# Altium schematic sheet CONVERTER.SchDoc
size A3; SheetNumber: 3; SheetTotal: 3
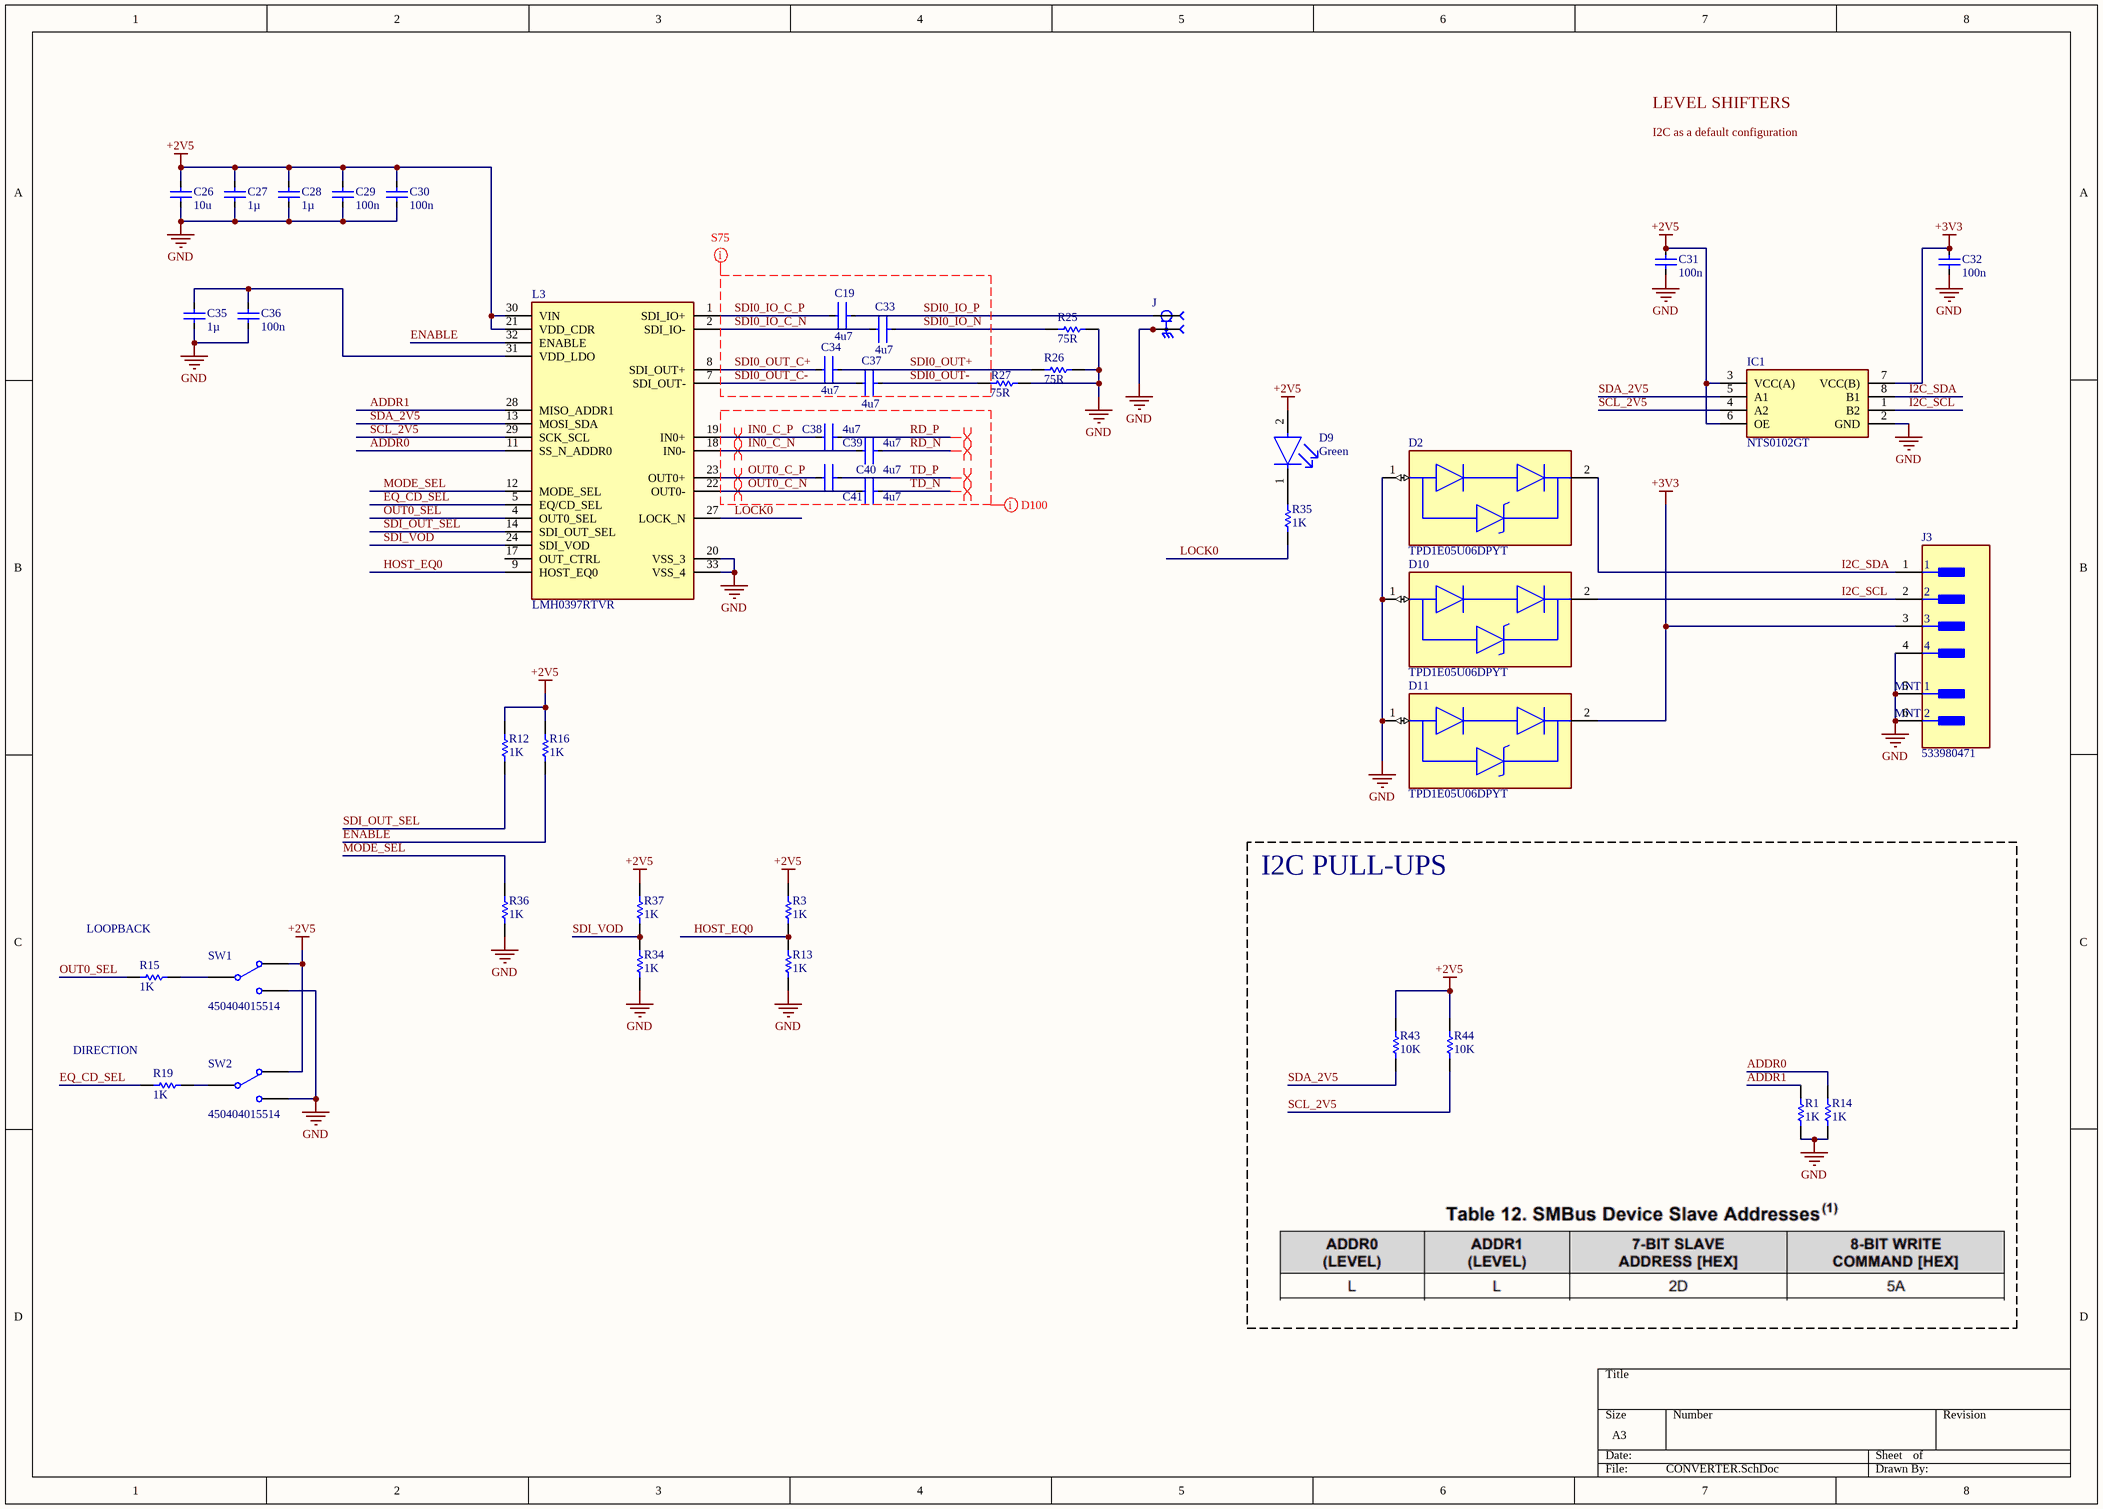
[diagram p0: CONVERTER.SchDoc]

## Parts
C19  value 4u7  [FP-GRM155-0_1-MFG]  (hidden comment: GRM155R60J475ME47D)
C26  value 10u  [FP-C1608-080-0_1-IPC_C]  (hidden comment: C1608JB0J106K080AB)
C27  value 1µ  [CAPC1005X55X10NL05]  (hidden comment: C1005X5R1A105K050BB)
C28  value 1µ  [CAPC1005X55X10NL05]  (hidden comment: C1005X5R1A105K050BB)
C29  value 100n  [FP-C1005-050-0_05-IPC_C]  (hidden comment: C1005X7R1H104K050BB)
C30  value 100n  [FP-C1005-050-0_05-IPC_C]  (hidden comment: C1005X7R1H104K050BB)
C31  value 100n  [FP-C1005-050-0_05-IPC_C]  (hidden comment: C1005X7R1H104K050BB)
C32  value 100n  [FP-C1005-050-0_05-IPC_C]  (hidden comment: C1005X7R1H104K050BB)
C33  value 4u7  [FP-GRM155-0_1-MFG]  (hidden comment: GRM155R60J475ME47D)
C34  value 4u7  [FP-GRM155-0_1-MFG]  (hidden comment: GRM155R60J475ME47D)
C35  value 1µ  [CAPC1005X55X10NL05]  (hidden comment: C1005X5R1A105K050BB)
C36  value 100n  [FP-C1005-050-0_05-IPC_C]  (hidden comment: C1005X7R1H104K050BB)
C37  value 4u7  [FP-GRM155-0_1-MFG]  (hidden comment: GRM155R60J475ME47D)
C38  value 4u7  [FP-GRM155-0_1-IPC_B]  (hidden comment: GRM155R60J475ME47D)
C39  value 4u7  [FP-GRM155-0_1-IPC_B]  (hidden comment: GRM155R60J475ME47D)
C40  value 4u7  [FP-GRM155-0_1-IPC_B]  (hidden comment: GRM155R60J475ME47D)
C41  value 4u7  [FP-GRM155-0_1-IPC_B]  (hidden comment: GRM155R60J475ME47D)
D2  TPD1E05U06DPYT  [FP-DPY0002A-MFG]
D9  Color: Green  [FP-LTST-C191GKT-MFG]  (hidden comment: LTST-C191GKT)
D10  TPD1E05U06DPYT  [FP-DPY0002A-MFG]
D11  TPD1E05U06DPYT  [FP-DPY0002A-MFG]
IC1  NTS0102GT  [NTS0102GT]
J  BNC7T-J-P-XX-ST-EM1D  [SAMTEC_BNC7T-J-P-XX-ST-EM1D]  (value not drawn)
J3  533980471  [FP-533980471-MFG]
L3  LMH0397RTVR  [QFN50P500X500X80-33N-D]
R1  value 1K  [RESC1005X40X25LL05T10]  (hidden comment: RC0402FR-071KL)
R3  value 1K  [RESC1005X40X25LL05T10]  (hidden comment: RC0402FR-071KL)
R12  value 1K  [RESC1005X40X25LL05T10]  (hidden comment: RC0402FR-071KL)
R13  value 1K  [RESC1005X40X25LL05T10]  (hidden comment: RC0402FR-071KL)
R14  value 1K  [RESC1005X40X25LL05T10]  (hidden comment: RC0402FR-071KL)
R15  value 1K  [RESC1005X40X25LL05T10]  (hidden comment: RC0402FR-071KL)
R16  value 1K  [RESC1005X40X25LL05T10]  (hidden comment: RC0402FR-071KL)
R19  value 1K  [RESC1005X40X25LL05T10]  (hidden comment: RC0402FR-071KL)
R25  value 75R  [RESC1005X40X25LL05T10]  (hidden comment: RC0402FR-0775RL)
R26  value 75R  [RESC1005X40X25LL05T10]  (hidden comment: RC0402FR-0775RL)
R27  value 75R  [RESC1005X40X25LL05T10]  (hidden comment: RC0402FR-0775RL)
R34  value 1K  [RESC1005X40X25LL05T10]  (hidden comment: RC0402FR-071KL)
R35  value 1K  [RESC1005X40X25LL05T10]  (hidden comment: RC0402FR-071KL)
R36  value 1K  [RESC1005X40X25LL05T10]  (hidden comment: RC0402FR-071KL)
R37  value 1K  [RESC1005X40X25LL05T10]  (hidden comment: RC0402FR-071KL)
R43  value 10K  [RESC1005X40X25LL05T10]  (hidden comment: RC0402FR-0710KL)
R44  value 10K  [RESC1005X40X25LL05T10]  (hidden comment: RC0402FR-0710KL)
SW1  450404015514  [450404015514]
SW2  450404015514  [450404015514]

## Blocks framed on the sheet
I2C PULL-UPS: R1 R14 R43 R44

## Nets
+2V5: C26.1 C27.1 C28.1 C29.1 C30.1 C31.1 D9.2(A) IC1.3(VCC(A)) IC1.6(OE) L3.21(VDD_CDR) L3.30(VIN) R3.1 R12.1 R16.1 R37.1 R43.1 R44.1 SW1.L1 SW2.L1
+3V3: C32.1 D11.2(GND) IC1.7(VCC(B)) J3.3
GND: C26.2 C27.2 C28.2 C29.2 C30.2 C31.2 C32.2 C35.2 C36.2 D2.1(I/O) D10.1(I/O) D11.1(I/O) IC1.2(GND) J.S1 J.S2 J.S3 J.S4 J3.4 J3.5(MNT_1) J3.6(MNT_2) L3.20(VSS_3) L3.33(VSS_4) R1.2 R13.2 R14.2 R25.2 R26.2 R27.2 R34.2 R36.2 SW1.L2 SW2.L2
ADDR0: L3.11(SS_N_ADDR0) R14.1
ADDR1: L3.28(MISO_ADDR1) R1.1
ENABLE: L3.32(ENABLE) R16.2
EQ_CD_SEL: L3.5(EQ/CD_SEL) R19.1
HOST_EQ0: L3.9(HOST_EQ0) R3.2 R13.1
I2C_SCL: D10.2(GND) IC1.1(B2) J3.2
I2C_SDA: D2.2(GND) IC1.8(B1) J3.1
IN0_C_N: C39.2 L3.18(IN0-)
IN0_C_P: C38.2 L3.19(IN0+)
LOCK0: L3.27(LOCK_N) R35.2
MODE_SEL: L3.12(MODE_SEL) R36.1
OUT0_C_N: C41.2 L3.22(OUT0-)
OUT0_C_P: C40.2 L3.23(OUT0+)
OUT0_SEL: L3.4(OUT0_SEL) R15.1
RD_N: C39.1
RD_P: C38.1
SCL_2V5: IC1.4(A2) L3.29(SCK_SCL) R44.2
SDA_2V5: IC1.5(A1) L3.13(MOSI_SDA) R43.2
SDI0_IO_C_N: C33.2 L3.2(SDI_IO-)
SDI0_IO_C_P: C19.2 L3.1(SDI_IO+)
SDI0_IO_N: C33.1 R25.1
SDI0_IO_P: C19.1 J.1
SDI0_OUT+: C34.1 R26.1
SDI0_OUT-: C37.1 R27.1
SDI0_OUT_C+: C34.2 L3.8(SDI_OUT+)
SDI0_OUT_C-: C37.2 L3.7(SDI_OUT-)
SDI_OUT_SEL: L3.14(SDI_OUT_SEL) R12.2
SDI_VOD: L3.24(SDI_VOD) R34.1 R37.2
TD_N: C41.1
TD_P: C40.1
NetC35_1: C35.1 C36.1 L3.31(VDD_LDO)
NetD9_1: D9.1(C) R35.1
NetR15_2: R15.2 SW1.COM
NetR19_2: R19.2 SW2.COM

Not connected (* = marked no-connect by the designer): L3 17(OUT_CTRL)

## Layout directives
differential pair: IN0_C_N, IN0_C_P, OUT0_C_N, OUT0_C_P, RD_N, RD_P, TD_N, TD_P
net class SDI: SDI0_IO_C_N, SDI0_IO_C_P, SDI0_IO_N, SDI0_IO_P, SDI0_OUT+, SDI0_OUT-, SDI0_OUT_C+, SDI0_OUT_C-
net class D100: IN0_C_N, IN0_C_P, OUT0_C_N, OUT0_C_P, RD_N, RD_P, TD_N, TD_P

## Notes on the sheet
- (near R15) LOOPBACK
- (near R19) DIRECTION
- Labels drawn without touching a wire or pin: I2C as a default configuration, LEVEL SHIFTERS

## Library data of the parts
C19 C33 C34 C37-C41 = CMP-2008-04549-2: Chip Multilayer Ceramic Capacitors for General Purpose, 0402, 4.7uF, X5R, 15%, 20%, 6.3V; Height: 0.5mm; Weight: 0.000212oz; Length: 1mm; Case Code (Metric): 1005; Packaging: Tape and Reel; Termination: SMD/SMT; Dielectric: X5R; Depth: 0.5mm; Case Code (Imperial): 0402; Min Operating Temperature: -55°C; Case/Package: 0402; Voltage: 6.3V; Width: 0.02inch; Lead Free: Lead Free; Thickness: 0.022inch; Contact Plating: Tin; REACH SVHC: No SVHC; Package Quantity: 10000; Tolerance: 20%; Voltage Rating (DC): 6.3V; Voltage Rating: 6.3V; Mount: Surface Mount; Max Operating Temperature: 85°C
C26 = C1608JB0J106K080AB: MLCC 10μF ±10% 6.3V JB SMD 0603; Dielectric Material: Ceramic; Case Code (Imperial): 0603; Thickness: 0.035inch; Min Operating Temperature: -25°C; Termination: SMD/SMT; Lead Free: Lead Free; Resistor Type: Ceramic; Width: 0.8mm; Voltage Rating (DC): 6.3V; Package Quantity: 4000; Tolerance: 10%; Length: 0.063inch; Series: C; Height: 0.8mm; Max Operating Temperature: 85°C; Mount: Surface Mount; RoHS Compliant: Yes; Voltage Rating: 6.3V; Case Code (Metric): 1608; Case/Package: 0603; Packaging: Tape and Reel
C27 C28 C35 = C1005X5R1A105K050BB: MLCC 1 uF, +/- 10%, 10 V, -55 to 85 degC, 0402 (1005 Metric), RoHS, Tape and Reel; Manufacturer: TDK; PCN Part Number: MLCCPartNumberChange30/Nov/2012; Product Training Modules: CSeriesGeneralApplicationsSEAT,CCV,andTVCLDesignToolsGuidetoReplacinganElectrolyticCapacitorwithanMLCC; Voltage - Rated: 10V; Temperature Coefficient: X5R; Online Catalog: CSeries,GeneralPurpose; Other Names: 445-4114-6; Category: Capacitors; Features: -; Lead Style: -; RoHS Information: RoHSCertificate-MLCC; Manufacturer URL: http://www.tdk.com/; Lead Spacing: -; Thickness (Max): 0.022"(0.55mm); Applications: GeneralPurpose; Tolerance: ±10%; Mounting Technology: SurfaceMount; Mounting Type: SurfaceMount,MLCC; Operating Temperature: -55°C~85°C; Datasheet URL: http://download.siliconexpert.com/pdfs/2015/4/21/15/54/45/779/tdk_/manual/37024850441143360mlcc_commercial_general_en.pdf; Package Reference: 1005; Height - Seated (Max): -; Family: CeramicCapacitors; Datasheet Version: 03/2015; Package Description: 2-Pin Surface Mount Device, Body 1 x 0.5 mm; Packaging: Digi-Reel®; Size / Dimension: 0.039"Lx0.020"W(1.00mmx0.50mm); Standard Package: 1; Package / Case: 0402(1005Metric); Ratings: -; Series: C; Part Number: C1005X5R1A105K050BB
C29-C32 C36 = C1005X7R1H104K050BB: MLCC 100nF ±10% 50V X7R SMD 0402; Dielectric Material: Ceramic; Voltage: 50V; Min Operating Temperature: -55°C; Depth: 0.5mm; Radiation Hardening: No; RoHS Compliant: Yes; Voltage Rating (DC): 50V; Lead Free: Lead Free; Resistor Type: Ceramic; Height: 0.5mm; Dielectric: X7R; Thickness: 0.022inch; Case/Package: 0402; Case Code (Metric): 1005; Termination: SMD/SMT; Packaging: Tape and Reel; Max Operating Temperature: 125°C; Mount: Surface Mount; Package Quantity: 1; Width: 0.02inch; Weight: 2.3E-05oz; Voltage Rating: 50V; Tolerance: 10%; Construction: Flat; Case Code (Imperial): 0402; Length: 1mm; REACH SVHC: No SVHC; Series: C; Part Number: C1005X7R1H104K050BB
D2 D10 D11 = CMP-04985-000007-1: TVS DIODE 5.5V 14V 2X1SON; Capacitance: 0.42pF; Number of Bidirectional Channels: 1; Max Power Dissipation: 40W; Test Current: 1mA; ESD Protection: Yes; Element Configuration: Single; Breakdown Voltage: 6.5V; Polarity: Bidirectional; Min Breakdown Voltage: 6V; Max Reverse Leakage Current: 10nA; Direction: Unidirectional; Peak Pulse Current: 2.5A; Interface: LVDS; Max Operating Temperature: 125°C; Mount: Surface Mount; Lead Free: Lead Free; Termination: SMD/SMT; Packaging: Tape and Reel; Clamping Voltage: 14V; Case/Package: 0402; Peak Pulse Power: 40W; Reverse Standoff Voltage: 5.5V; Height: 0.4mm; Number of Channels: 1; Working Voltage: 5.5V; Power Line Protection: Yes; Number of Pins: 2; Length: 1.1mm; Leakage Current: 10nA; Operating Supply Voltage: 5.5V; Radiation Hardening: No; Package Quantity: 250; REACH SVHC: No SVHC; Width: 0.7mm; Min Operating Temperature: -40°C
D9 = CMP-22017-000029-1: LED GREEN CLEAR CHIP SMD; Power Dissipation: 100mW; Lens Color: Colorless; Number of Elements: 1; Dominant Wavelength: 569nm; Forward Voltage: 2.1V; Forward Current: 30mA; Test Current: 20mA; Viewing Angle: 130°; Wavelength: 565nm; Luminous Intensity: 12mcd; Reverse Voltage: 5V; Case/Package: 0603; Package Quantity: 1; Illumination Color: Green; Lens Style: Clear; Lens Transparency: Clear; Depth: 0.8mm; Power Rating: 100mW; Width: 0.8mm; Height: 0.55mm; Radiation Hardening: No; Case Code (Imperial): 0603; Number of Pins: 2; Length: 1.6mm; Case Code (Metric): 1608; Max Operating Temperature: 85°C; Packaging: Tape and Reel; Mount: Surface Mount; Min Operating Temperature: -55°C; Lead Free: Lead Free; Number of LEDs: 1
IC1 = NTS0102GT: Integrated Circuit; Manufacturer_Name: NXP; Datasheet Link: https://www.nxp.com/docs/en/data-sheet/NTS0102.pdf; Height: 0.5mm; Manufacturer_Part_Number: NTS0102GT; Mouser Part Number: N/A; Mouser Price/Stock: https://www.mouser.co.uk/ProductDetail/NXP-Semiconductors/NTS0102GT?qs=fAHHVMwC%252BbiEwQ74lfEnvg%3D%3D
J = BNC7T-J-P-XX-ST-EM1D: BNC Connector Jack, Female Socket 75Ohm Board Edge, End Launch; Panel Mount Solder; MP: BNC7T-J-P-GN-ST-EM1D; MF: Samtec Inc.; Package: None; DigiKey-Purchase-URL: https://snapeda.com/shop?store=DigiKey&id=3266999; Price: None; SnapEDA_Link: https://www.snapeda.com/parts/BNC7T-J-P-GN-ST-EM1D/Samtec%20Inc./view-part/3266999/?ref=snap; Toby_UK-Purchase-URL: https://snapeda.com/shop?store=Toby+UK&id=3266999; Value: *; Availability: Unavailable
J3 = CMP-04776-000105-1: CONN HEADER SMD 4POS 1.25MM; Manufacturer: Molex; Conn Gender: Male; Conn Orientation: Vertical; Standoff Height: 0.05mm; Number Of Contacts: 4; Current Rating: 1A; Voltage Rating: 125V; Package: 0; ComponentLink2Description: Datasheet; ComponentLink2URL: https://www.molex.com/pdm_docs/ps/PS-51021-024-001.pdf; Ambient Temperature Range Low: -40°C; Category: Conn; Automotive: No; Number Of Rows: 1; Device Class L3: unset; Ambient Temperature Range High: +105°C; Height: 5.1mm; Lead Free: Yes; Pitch: 1.25mm; Contact Material: Tin; Footprint Url: https://www.molex.com/pdm_docs/sd/533980471_sd.pdf; Octopart: https://octopart.com/53398-0471-molex-655296; Temperature Range Low: -40°C; Device Class L2: Headers and Wire Housings; Temperature: -40°C to +105°C; Digikey Description: CONN HEADER SMD 4POS 1.25MM; RoHS: TRUE; Manufacturer Part Number: 533980471; Device Class L1: Connectors; Temperature Range High: +105°C
L3 = LMH0397RTVR: The LMH0397 is a 3G-SDI 75-Ω bidirectional I/O with integrated reclocker.; Manufacturer_Name: Texas Instruments; Datasheet Link: https://www.ti.com/lit/ds/symlink/lmh0397.pdf?HQS=dis-dk-null-digikeymode-dsf-pf-null-wwe&ts=1630762637746; Height: 0.8mm; Manufacturer_Part_Number: LMH0397RTVR; Mouser Part Number: 595-LMH0397RTVR; Mouser Price/Stock: https://www.mouser.co.uk/ProductDetail/Texas-Instruments/LMH0397RTVR?qs=5aG0NVq1C4zpBN83bcpBMQ%3D%3D; Arrow Part Number: LMH0397RTVR; Arrow Price/Stock: https://www.arrow.com/en/products/lmh0397rtvr/texas-instruments?utm_currency=USD&region=nac
R1 R3 R12-R16 R19 R34-R37 = CMP-2002-07353-1: Part Number: RC0402FR-070RL; Manufacturer: Yageo / Phycomp
R25-R27 = CMP-2002-07798-1: Manufacturer: Yageo / Phycomp; Part Number: RC0402FR-0775RL
R43 R44 = CMP-2002-07353-1: Manufacturer: Yageo / Phycomp; Part Number: RC0402FR-0710KL
SW1 SW2 = CMP-03913-99472344-3: Slide Switch, 0.3A, 5Vdc, Smd Rohs Compliant: Yes; Manufacturer Lifecycle Status: ACTIVE; Current Rating: 300mA; YEOL: 1 = Estimated lifetime > 10 years; Insulation Resistance: 100MΩ; Voltage Rating: 5V; Max Operating Temperature: 85°C; Min Operating Temperature: -40°C; Packaging: Tape and Reel; Lifecycle Status: Production; RoHS: Compliant; Contact Plating: Silver